# EAGLE schematic TransientsVCFG_half (EAGLE 9.6.2)
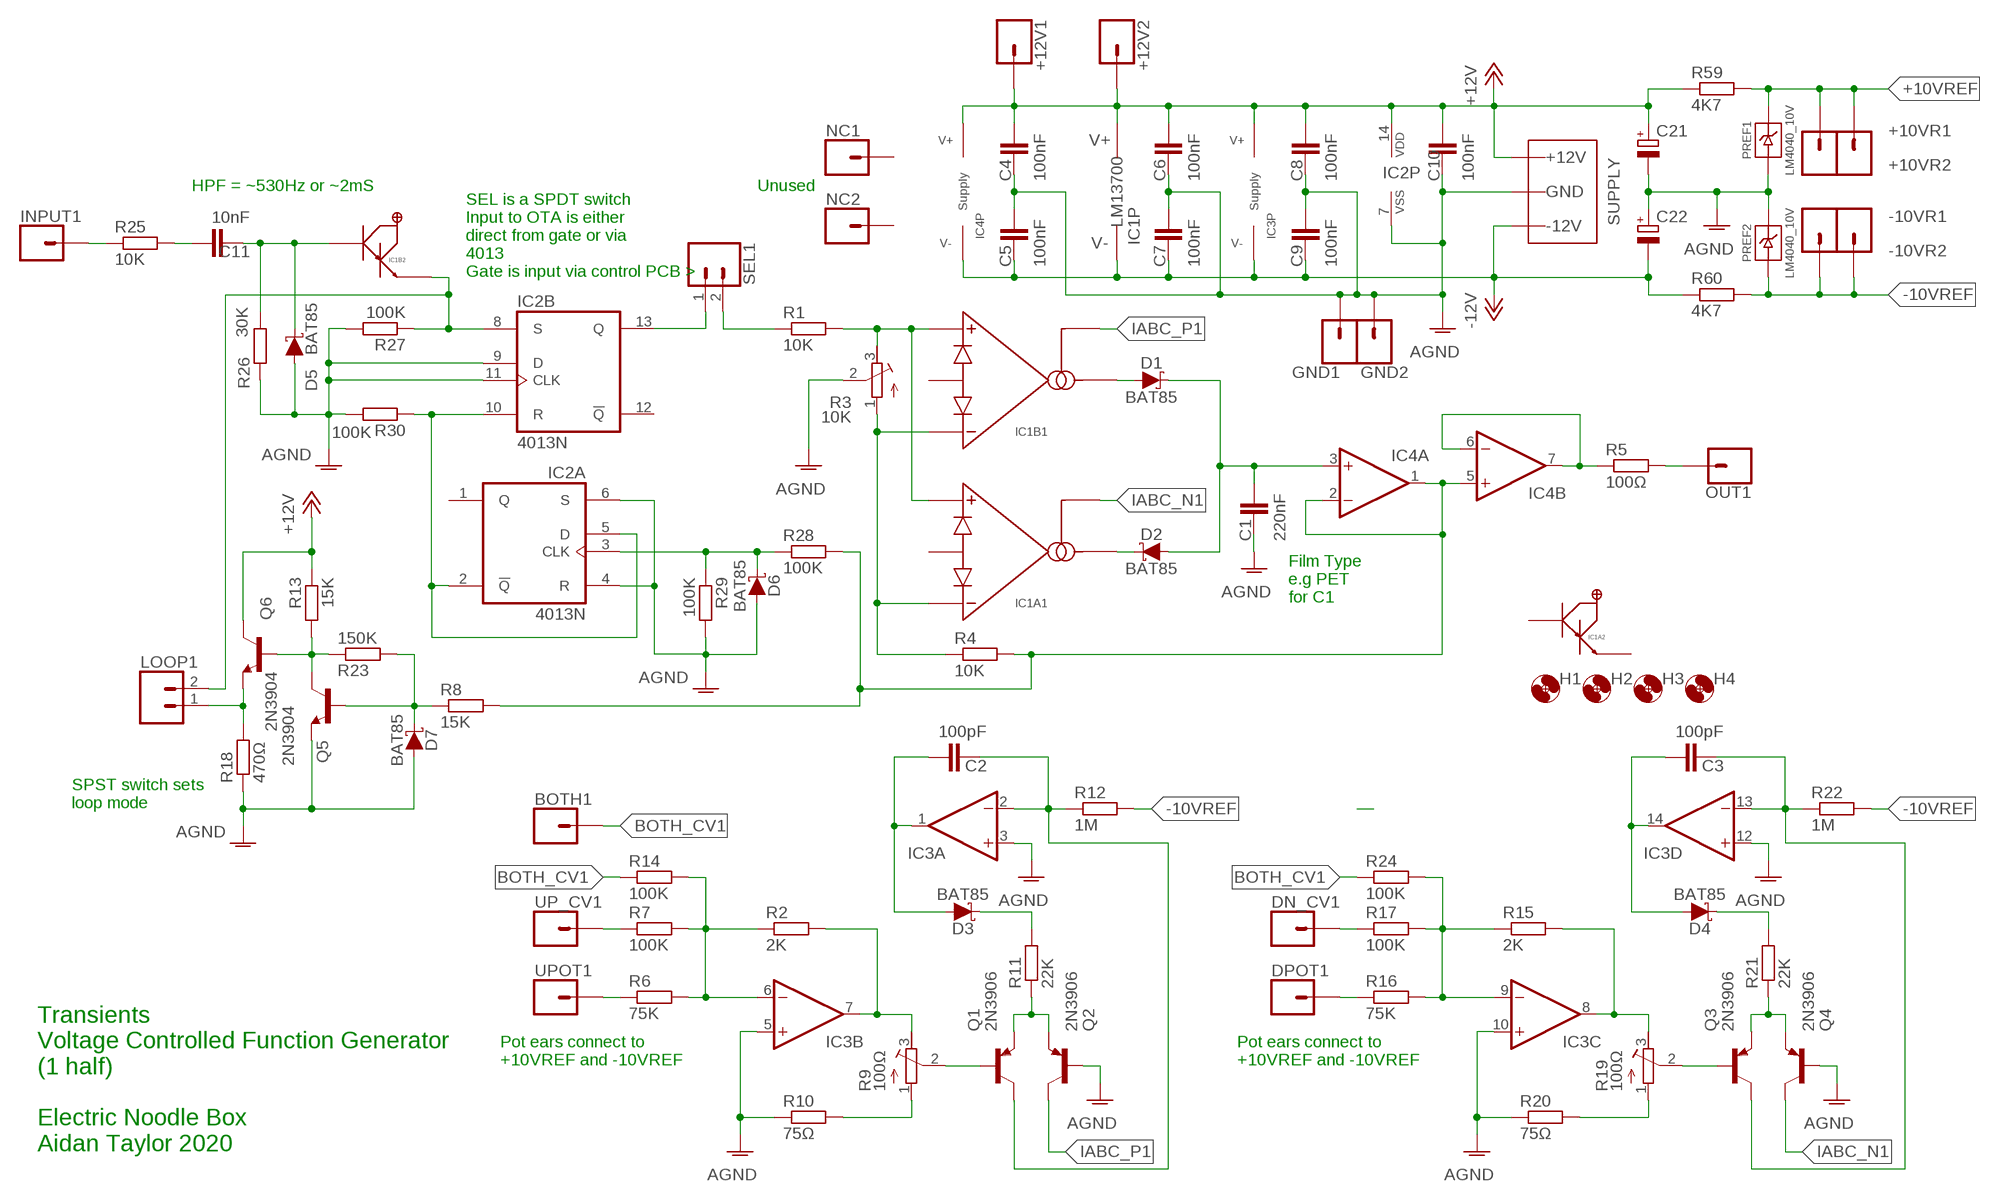
[diagram p0: schematic, sheet 1]

## Parts
+10VR1  1XWIREPAD  [1X01]
+10VR2  1XWIREPAD  [1X01]
+12V1  1XWIREPAD  [1X01]
+12V2  1XWIREPAD  [1X01]
-10VR1  1XWIREPAD  [1X01]
-10VR2  1XWIREPAD  [1X01]
BOTH1  1XWIREPAD  [1X01]
C1  220nF  C-EU050-025X075  [C050-025X075]
C2  100pF  C-EU050-025X075  [C050-025X075]
C3  100pF  C-EU050-025X075  [C050-025X075]
C4  100nF  C-EU050-025X075  [C050-025X075]
C5  100nF  C-EU050-025X075  [C050-025X075]
C6  100nF  C-EU050-025X075  [C050-025X075]
C7  100nF  C-EU050-025X075  [C050-025X075]
C8  100nF  C-EU050-025X075  [C050-025X075]
C9  100nF  C-EU050-025X075  [C050-025X075]
C10  100nF  C-EU050-025X075  [C050-025X075]
C11  10nF  C-EU050-025X075  [C050-025X075]
C21  CPOL-EUE2.5-6  [E2,5-6]
C22  CPOL-EUE2.5-6  [E2,5-6]
D1  BAT85  SCHOTTKY_DO35  [DO35-7]
D2  BAT85  SCHOTTKY_DO35  [DO35-7]
D3  BAT85  SCHOTTKY_DO35  [DO35-7]
D4  BAT85  SCHOTTKY_DO35  [DO35-7]
D5  BAT85  SCHOTTKY_DO35  [DO35-7]
D6  BAT85  SCHOTTKY_DO35  [DO35-7]
D7  BAT85  SCHOTTKY_DO35  [DO35-7]
DN_CV1  1XWIREPAD  [1X01]
DPOT1  1XWIREPAD  [1X01]
GND1  1XWIREPAD  [1X01]
GND2  1XWIREPAD  [1X01]
H1  MOUNT-HOLE3.2  [3,2]
H2  MOUNT-HOLE3.2  [3,2]
H3  MOUNT-HOLE3.2  [3,2]
H4  MOUNT-HOLE3.2  [3,2]
IC1  LM13700DIL  [DIL16]
IC2  4013N  [DIL14]
IC3  TL0X4DIL  [DIL14]
IC4  TL0X2DIL  [DIL08]
INPUT1  1XWIREPAD  [1X01]
LOOP1  2XWIREPAD  [1X02]
NC1  1XWIREPAD  [1X01]
NC2  1XWIREPAD  [1X01]
OUT1  1XWIREPAD  [1X01]
PREF1  LM4040_10V  LM4040TH  [TO92]
PREF2  LM4040_10V  LM4040TH  [TO92]
Q1  2N3906  [TO92]
Q2  2N3906  [TO92]
Q3  2N3906  [TO92]
Q4  2N3906  [TO92]
Q5  2N3904  [TO92]
Q6  2N3904  [TO92]
R1  10K  R-EU_0207/10  [0207/10]
R2  2K  R-EU_0207/10  [0207/10]
R3  10K  R-TRIMM3296W  [RTRIM3296W]
R4  10K  R-EU_0207/10  [0207/10]
R5  100Ω  R-EU_0207/10  [0207/10]
R6  75K  R-EU_0207/10  [0207/10]
R7  100K  R-EU_0207/10  [0207/10]
R8  15K  R-EU_0207/10  [0207/10]
R9  100Ω  R-TRIMM3296W  [RTRIM3296W]
R10  75Ω  R-EU_0207/10  [0207/10]
R11  22K  R-EU_0207/10  [0207/10]
R12  1M  R-EU_0207/10  [0207/10]
R13  15K  R-EU_0207/10  [0207/10]
R14  100K  R-EU_0207/10  [0207/10]
R15  2K  R-EU_0207/10  [0207/10]
R16  75K  R-EU_0207/10  [0207/10]
R17  100K  R-EU_0207/10  [0207/10]
R18  470Ω  R-EU_0207/10  [0207/10]
R19  100Ω  R-TRIMM3296W  [RTRIM3296W]
R20  75Ω  R-EU_0207/10  [0207/10]
R21  22K  R-EU_0207/10  [0207/10]
R22  1M  R-EU_0207/10  [0207/10]
R23  150K  R-EU_0207/10  [0207/10]
R24  100K  R-EU_0207/10  [0207/10]
R25  10K  R-EU_0207/10  [0207/10]
R26  30K  R-EU_0207/10  [0207/10]
R27  100K  R-EU_0207/10  [0207/10]
R28  100K  R-EU_0207/10  [0207/10]
R29  100K  R-EU_0207/10  [0207/10]
R30  100K  R-EU_0207/10  [0207/10]
R59  4K7  R-EU_0207/10  [0207/10]
R60  4K7  R-EU_0207/10  [0207/10]
SEL1  2XWIREPAD  [1X02]
UP_CV1  1XWIREPAD  [1X01]
UPOT1  1XWIREPAD  [1X01]
WP1  COMBO_SUPPLY_HEADER  [COMBINED_POWER]

## Nets
+10VREF: +10VR1.1 +10VR2.1 PREF1.2(CATHODE) R59.2
+12V: +12V1.1 +12V2.1 C4.1 C6.1 C8.1 C10.1 C21.+ IC1.11(P:V+) IC2.14(P:VDD) IC3.4(P:V+) IC4.8(P:V+) Q6.1(C) R13.1 R59.1 WP1.V+1(V++) WP1.V+2(V++) WP1.V+3(V++)
-10VREF: -10VR1.1 -10VR2.1 PREF2.3(ANODE) R12.2 R22.2 R60.2
-12V: C5.2 C7.2 C9.2 C22.- IC1.6(P:V-) IC3.11(P:V-) IC4.4(P:V-) R60.1 WP1.V-1(V--) WP1.V-2(V--) WP1.V-3(V--)
AGND: C1.2 C4.2 C5.1 C6.2 C7.1 C8.2 C9.1 C10.2 C21.- C22.+ D5.A D6.A D7.A GND1.1 GND2.1 IC2.4(A:R) IC2.6(A:S) IC2.7(P:VSS) IC2.9(B:D) IC2.11(B:CLK) IC3.3(A:+IN) IC3.5(B:+IN) IC3.10(C:+IN) IC3.12(D:+IN) PREF1.3(ANODE) PREF2.2(CATHODE) Q2.2(B) Q4.2(B) Q5.3(E) R3.2(S) R10.1 R18.1 R20.1 R26.1 R27.2 R29.2 R30.2 WP1.GND1(AGND) WP1.GND2(AGND) WP1.GND3(AGND) WP1.GND4(AGND) WP1.GND5(AGND) WP1.GND6(AGND) WP1.GND7(AGND) WP1.GND8(AGND)
BOTH_CV1: BOTH1.1 R14.1 R24.1
IABC_N1: IC1.1(A1:AMPBIAS) Q4.1(C)
IABC_P1: IC1.16(B1:AMPBIAS) Q2.1(C)
N$1: IC1.3(A1:AMP+) IC1.14(B1:AMP+) R1.2 R3.3(E)
N$2: D1.A IC1.12(B1:AMPOUT)
N$3: C1.1 D1.C D2.A IC4.3(A:+IN)
N$4: IC4.1(A:OUT) IC4.2(A:-IN) IC4.5(B:+IN) R4.2 R8.2 R28.2
N$5: D2.C IC1.5(A1:AMPOUT)
N$6: IC4.6(B:-IN) IC4.7(B:OUT) R5.1
N$7: IC1.4(A1:AMP-) IC1.13(B1:AMP-) R3.1(A) R4.1
N$8: IC3.6(B:-IN) R2.1 R6.2 R7.2 R14.2
N$9: IC3.7(B:OUT) R2.2 R9.3(E)
N$10: R9.1(A) R10.2
N$11: Q1.2(B) R9.2(S)
N$12: Q1.3(E) Q2.3(E) R11.1
N$13: C2.1 D3.A IC3.1(A:OUT)
N$14: C2.2 IC3.2(A:-IN) Q1.1(C) R12.1
N$15: D3.C R11.2
N$16: C11.1 R25.2
N$17: C11.2 D5.C IC1.10(B2:BUFF_IN) R26.2
N$18: R7.1 UP_CV1.1
N$19: OUT1.1 R5.2
N$20: IC3.9(C:-IN) R15.1 R16.2 R17.2 R24.2
N$21: R6.1 UPOT1.1
N$22: IC3.8(C:OUT) R15.2 R19.3(E)
N$23: R19.1(A) R20.2
N$24: Q3.2(B) R19.2(S)
N$25: Q3.3(E) Q4.3(E) R21.1
N$26: C3.1 D4.A IC3.14(D:OUT)
N$27: C3.2 IC3.13(D:-IN) Q3.1(C) R22.1
N$28: IC1.9(B2:BUFF_OUT) IC2.8(B:S) LOOP1.2 R27.1
N$29: D4.C R21.2
N$30: Q5.1(C) Q6.2(B) R13.2 R23.1
N$31: DN_CV1.1 R17.1
N$32: DPOT1.1 R16.1
N$33: R1.1 SEL1.2
N$34: IC2.13(B:Q) SEL1.1
N$36: INPUT1.1 R25.1
N$37: IC2.2(A:!Q) IC2.5(A:D) IC2.10(B:R) R30.1
N$38: LOOP1.1 Q6.3(E) R18.2
N$39: D7.C Q5.2(B) R8.1 R23.2
N$41: D6.C IC2.3(A:CLK) R28.1 R29.1
Unconnected: IC1.2(A1:DIODES) IC1.7(A2:BUFF_IN) IC1.8(A2:BUFF_OUT) IC1.15(B1:DIODES) IC2.1(A:Q) IC2.12(B:!Q) NC1.1 NC2.1

## Notes on the sheet
- HPF = ~530Hz or ~2mS | Unused
- SEL is a SPDT switch
  Input to OTA is either 
  direct from gate or via
  4013
  Gate is input via control PCB >
- Film Type
  e.g PET
  for C1
- SPST switch sets
  loop mode
- Pot ears connect to
  +10VREF and -10VREF
- Pot ears connect to
  +10VREF and -10VREF
- Transients 
  Voltage Controlled Function Generator
  (1 half)
  
  Electric Noodle Box
  Aidan Taylor 2020

## Library data of the parts
+10VR1 +10VR2 +12V1 +12V2 -10VR1 -10VR2 BOTH1 DN_CV1 DPOT1 GND1 GND2 INPUT1 NC1 NC2 OUT1 UP_CV1 UPOT1 = ElectricNoodleBox:1XWIREPAD
C1-C11 = rcl:C-EU: CAPACITOR, European symbol; SPICEPREFIX: C
C21 C22 = rcl:CPOL-EU: POLARIZED CAPACITOR, European symbol; SPICEPREFIX: C
D1-D7 = ElectricNoodleBox:SCHOTTKY_DO35
H1-H4 = holes:MOUNT-HOLE: MOUNTING HOLE with drill center marker
IC1 = ElectricNoodleBox:LM13700: Dual Transconductance Amplifier with Darlington Buffer; CATALOGUE: 3118206; RETAILER: Farnell
IC2 = 40xx:4013: Dual D FLIP FLOP, set/reset
IC3 = ElectricNoodleBox:TL0X4: Quad Operational Amplifier; CATALOGUE: 3005140; RETAILER: Farnell
IC4 = ElectricNoodleBox:TL0X2: Dual Operational Amplifier; CATALOGUE: 1103189; RETAILER: Farnell
LOOP1 SEL1 = ElectricNoodleBox:2XWIREPAD
PREF1 PREF2 = ElectricNoodleBox:LM4040
Q1-Q4 = transistor-pnp:2N3906: PNP Transistor
Q5 Q6 = transistor-npn:2N3904: NPN Transistor
R1 R2 R4-R8 R10-R18 R20-R30 R59 R60 = rcl:R-EU_: RESISTOR, European symbol; SPICEPREFIX: R
R3 R9 R19 = rcl:R-TRIMM: Trimm resistor; SPICEMODEL: X; SPICEPREFIXL: POT
WP1 = ElectricNoodleBox:COMBO_SUPPLY_HEADER